# EAGLE design MaxOr (EAGLE 7.3.0)
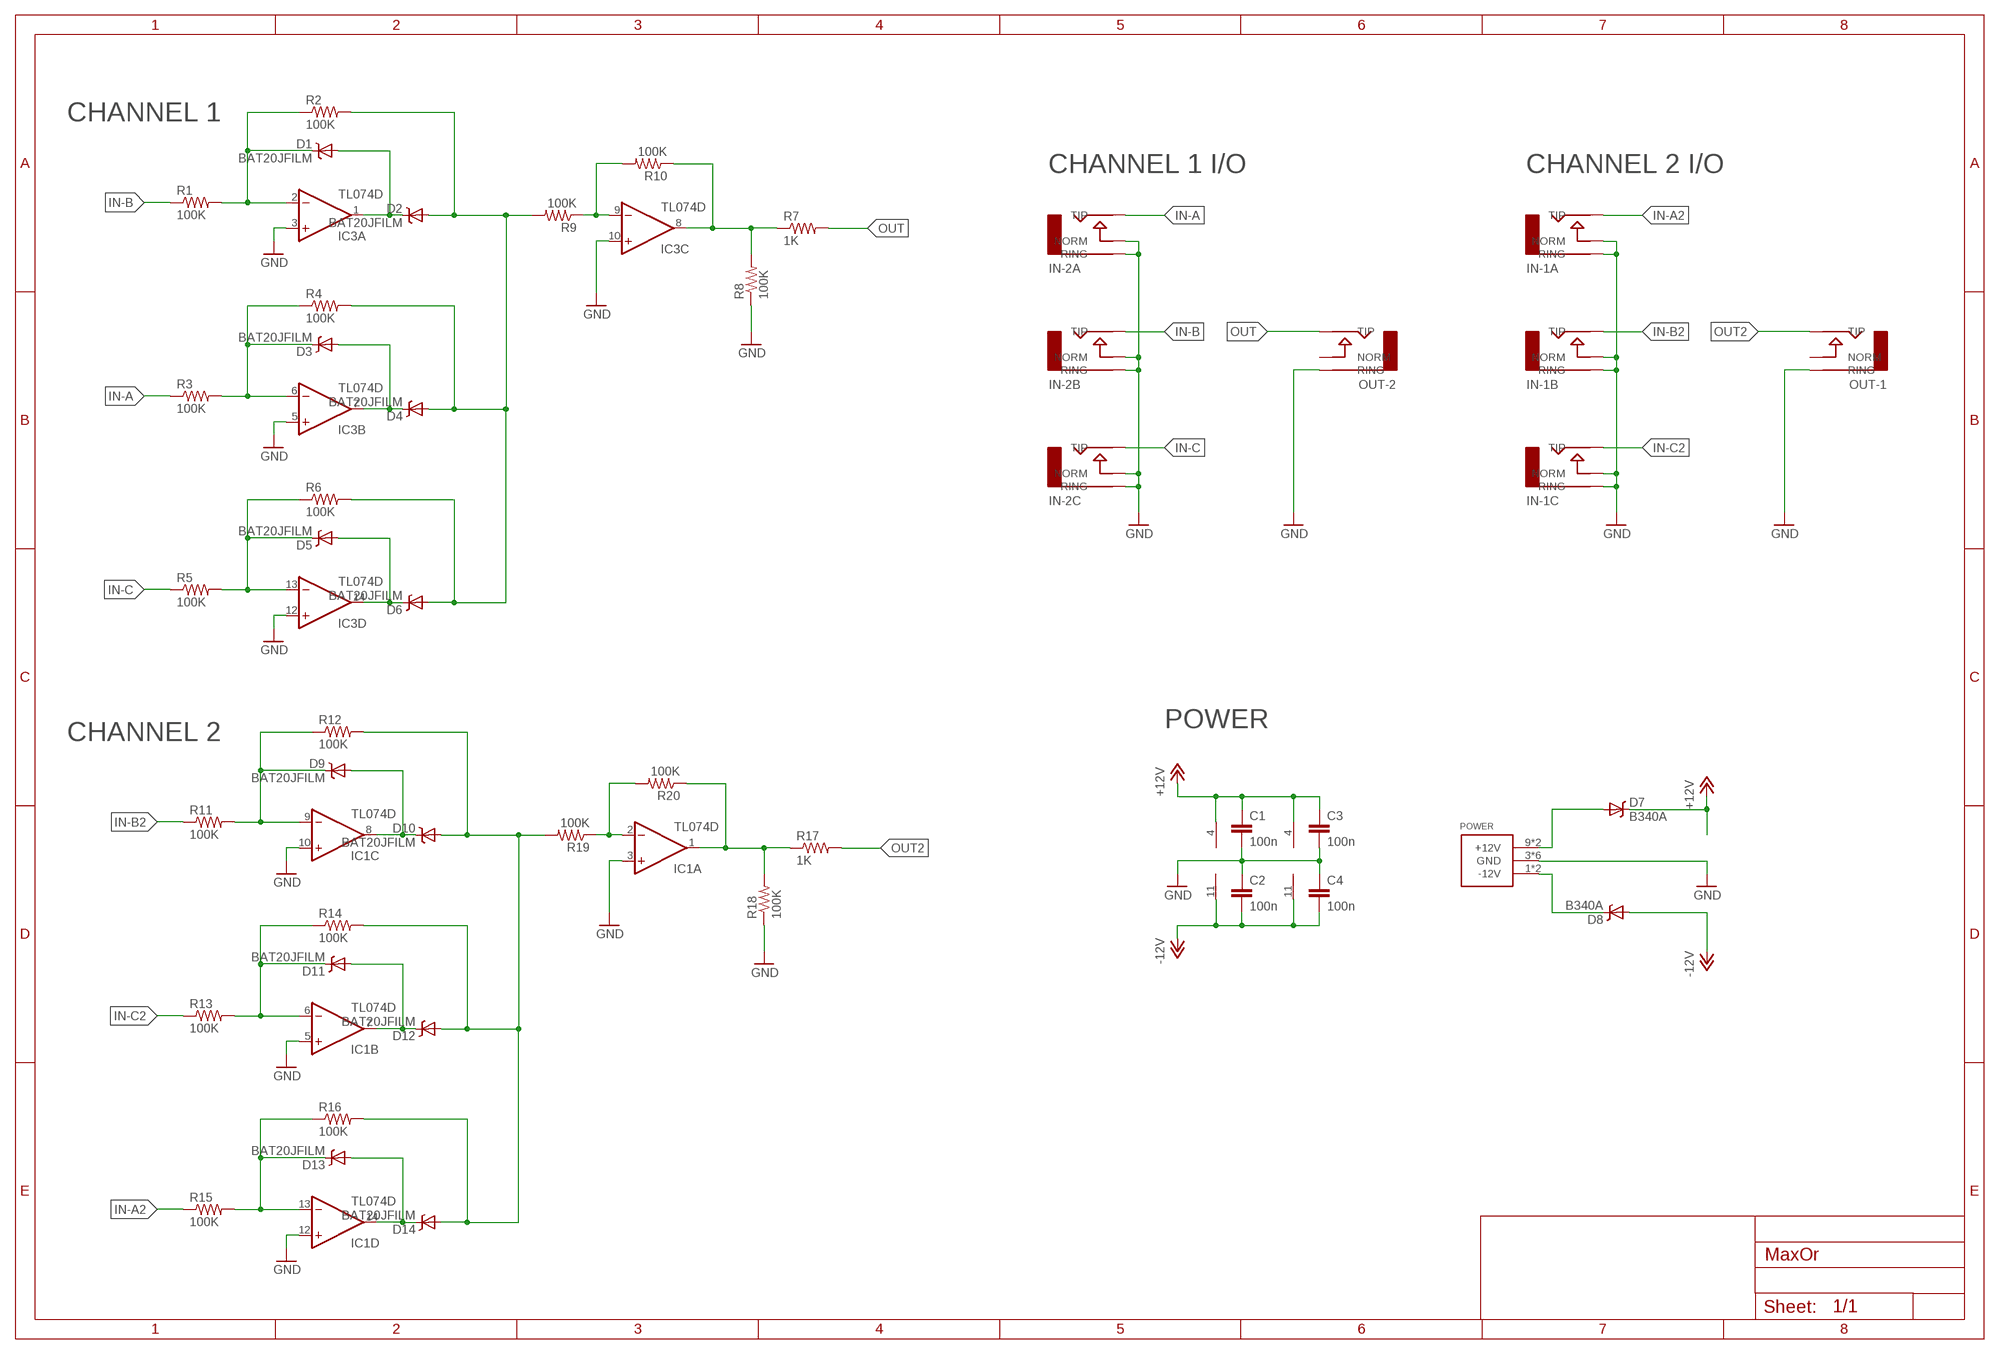
[diagram p0: schematic, sheet 1]

## Parts
C1  100n  CAP0805  [0805]
C2  100n  CAP0805  [0805]
C3  100n  CAP0805  [0805]
C4  100n  CAP0805  [0805]
D1  BAT20JFILM  [SOD-323]
D2  BAT20JFILM  [SOD-323]
D3  BAT20JFILM  [SOD-323]
D4  BAT20JFILM  [SOD-323]
D5  BAT20JFILM  [SOD-323]
D6  BAT20JFILM  [SOD-323]
D7  B340A  DIODE-SCHOTTKY-B340A  [SMA-DIODE]
D8  B340A  DIODE-SCHOTTKY-B340A  [SMA-DIODE]
D9  BAT20JFILM  [SOD-323]
D10  BAT20JFILM  [SOD-323]
D11  BAT20JFILM  [SOD-323]
D12  BAT20JFILM  [SOD-323]
D13  BAT20JFILM  [SOD-323]
D14  BAT20JFILM  [SOD-323]
IC1  TL074D  [SO14]
IC3  TL074D  [SO14]
IN-1A  AUDIO-JACK  [ERTHENVAR-JACK-HORIZONTAL]
IN-1B  AUDIO-JACK  [ERTHENVAR-JACK-HORIZONTAL]
IN-1C  AUDIO-JACK  [ERTHENVAR-JACK-HORIZONTAL]
IN-2A  AUDIO-JACK  [ERTHENVAR-JACK-HORIZONTAL]
IN-2B  AUDIO-JACK  [ERTHENVAR-JACK-HORIZONTAL]
IN-2C  AUDIO-JACK  [ERTHENVAR-JACK-HORIZONTAL]
OUT-1  AUDIO-JACK  [ERTHENVAR-JACK-HORIZONTAL]
OUT-2  AUDIO-JACK  [ERTHENVAR-JACK-HORIZONTAL]
POWER  POWER_SIMPLE10  [POWER_10]
R1  100K  RESISTOR0805-RES  [0805]
R2  100K  RESISTOR0805-RES  [0805]
R3  100K  RESISTOR0805-RES  [0805]
R4  100K  RESISTOR0805-RES  [0805]
R5  100K  RESISTOR0805-RES  [0805]
R6  100K  RESISTOR0805-RES  [0805]
R7  1K  RESISTOR0805-RES  [0805]
R8  100K  RESISTOR0805-RES  [0805]
R9  100K  RESISTOR0805-RES  [0805]
R10  100K  RESISTOR0805-RES  [0805]
R11  100K  RESISTOR0805-RES  [0805]
R12  100K  RESISTOR0805-RES  [0805]
R13  100K  RESISTOR0805-RES  [0805]
R14  100K  RESISTOR0805-RES  [0805]
R15  100K  RESISTOR0805-RES  [0805]
R16  100K  RESISTOR0805-RES  [0805]
R17  1K  RESISTOR0805-RES  [0805]
R18  100K  RESISTOR0805-RES  [0805]
R19  100K  RESISTOR0805-RES  [0805]
R20  100K  RESISTOR0805-RES  [0805]

## Nets
+12V: C1.1 C3.1 D7.C IC1.4(P:V+) IC3.4(P:V+)
-12V: C2.2 C4.2 D8.A IC1.11(P:V-) IC3.11(P:V-)
BUFFER: IC3.8(C:OUT) R7.1 R8.2 R10.1
BUFFER1: IC1.1(A:OUT) R17.1 R18.2 R20.1
GND: C1.2 C2.1 C3.2 C4.1 IC1.3(A:+IN) IC1.5(B:+IN) IC1.10(C:+IN) IC1.12(D:+IN) IC3.3(A:+IN) IC3.5(B:+IN) IC3.10(C:+IN) IC3.12(D:+IN) IN-1A.N(NORM) IN-1A.R@2(RING) IN-1B.N(NORM) IN-1B.R@2(RING) IN-1C.N(NORM) IN-1C.R@2(RING) IN-2A.N(NORM) IN-2A.R@2(RING) IN-2B.N(NORM) IN-2B.R@2(RING) IN-2C.N(NORM) IN-2C.R@2(RING) OUT-1.R@2(RING) OUT-2.R@2(RING) POWER.3(GND) POWER.4(GND) POWER.5(GND) POWER.6(GND) POWER.7(GND) POWER.8(GND) R8.1 R18.1
IN-A: IN-2A.T(TIP) R3.1
IN-A2: IN-1A.T(TIP) R15.1
IN-B: IN-2B.T(TIP) R1.1
IN-B2: IN-1B.T(TIP) R11.1
IN-C: IN-2C.T(TIP) R5.1
IN-C2: IN-1C.T(TIP) R13.1
N$1: D1.A D2.C IC3.1(A:OUT)
N$2: D3.A D4.C IC3.7(B:OUT)
N$3: D1.C IC3.2(A:-IN) R1.2 R2.1
N$4: D3.C IC3.6(B:-IN) R3.2 R4.1
N$5: D5.A D6.C IC3.14(D:OUT)
N$6: D5.C IC3.13(D:-IN) R5.2 R6.1
N$8: D7.A POWER.9(+12V) POWER.10(+12V)
N$9: D8.C POWER.1(-12V) POWER.2(-12V)
N$16: IC3.9(C:-IN) R9.1 R10.2
N$17: D9.A D10.C IC1.8(C:OUT)
N$18: D9.C IC1.9(C:-IN) R11.2 R12.1
N$19: D11.A D12.C IC1.7(B:OUT)
N$20: D11.C IC1.6(B:-IN) R13.2 R14.1
N$21: D13.A D14.C IC1.14(D:OUT)
N$22: D13.C IC1.13(D:-IN) R15.2 R16.1
N$23: IC1.2(A:-IN) R19.1 R20.2
OUT: OUT-2.T(TIP) R7.2
OUT2: OUT-1.T(TIP) R17.2
PREBUFFERED: D2.A D4.A D6.A R2.2 R4.2 R6.2 R9.2
PREBUFFERED1: D10.A D12.A D14.A R12.2 R14.2 R16.2 R19.2
Unconnected: OUT-1.N(NORM) OUT-2.N(NORM)

## Notes on the sheet
- CHANNEL 1
- CHANNEL 1 I/O | CHANNEL 2 I/O
- POWER
- CHANNEL 2

## Library data of the parts
C1-C4 = SparkFun-Capacitors:CAP: Capacitor Standard 0603 ceramic capacitor, and 0.1" leaded capacitor.
D1-D6 D9-D14 = SparkFun-DiscreteSemi:BAT20JFILM: 23V, 1A Schottky diode, SOD-323 package; PROD_ID: DIO-11623
D7 D8 = SparkFun-DiscreteSemi:DIODE-SCHOTTKY: Schottky diodes in SFE's production catalog BAT20J 1A 23V 0.62Vf RB751 120mA 40V 0.37Vf PMEG4005EJ 0.5A 40V 0.42Vf MBRA140 1A 40V 0.5Vf B340A 3A 40V SMA; PROD_ID: DIO-09886
IC1 IC3 = linear:TL074: OP AMP
IN-1A IN-1B IN-1C IN-2A IN-2B IN-2C OUT-1 OUT-2 = erthenvar:AUDIO-JACK: Switching Mono 3.5mm Audio Jack from Erthenvar. Horizontal package.
POWER = eurorack:POWER_SIMPLE
R1-R20 = SparkFun-Resistors:RESISTOR: Resistor Basic schematic elements and footprints for 0603, 1206, and PTH resistors.

## Board
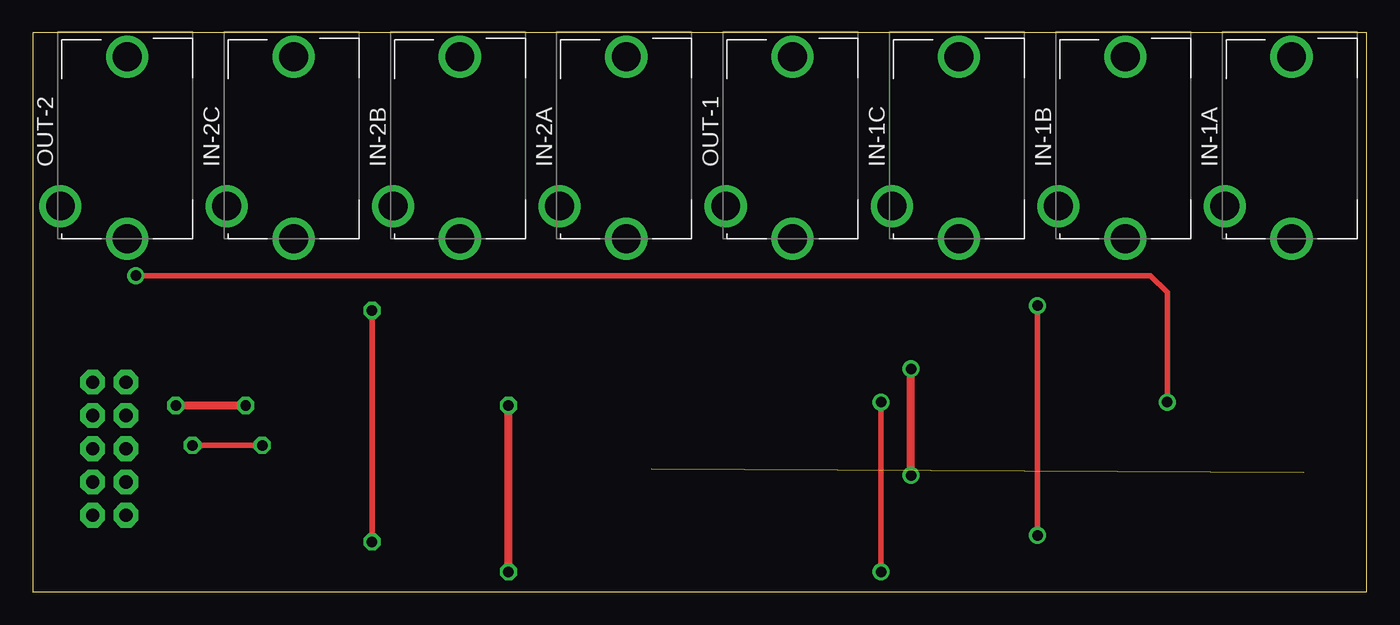
[diagram p1: board, top side]
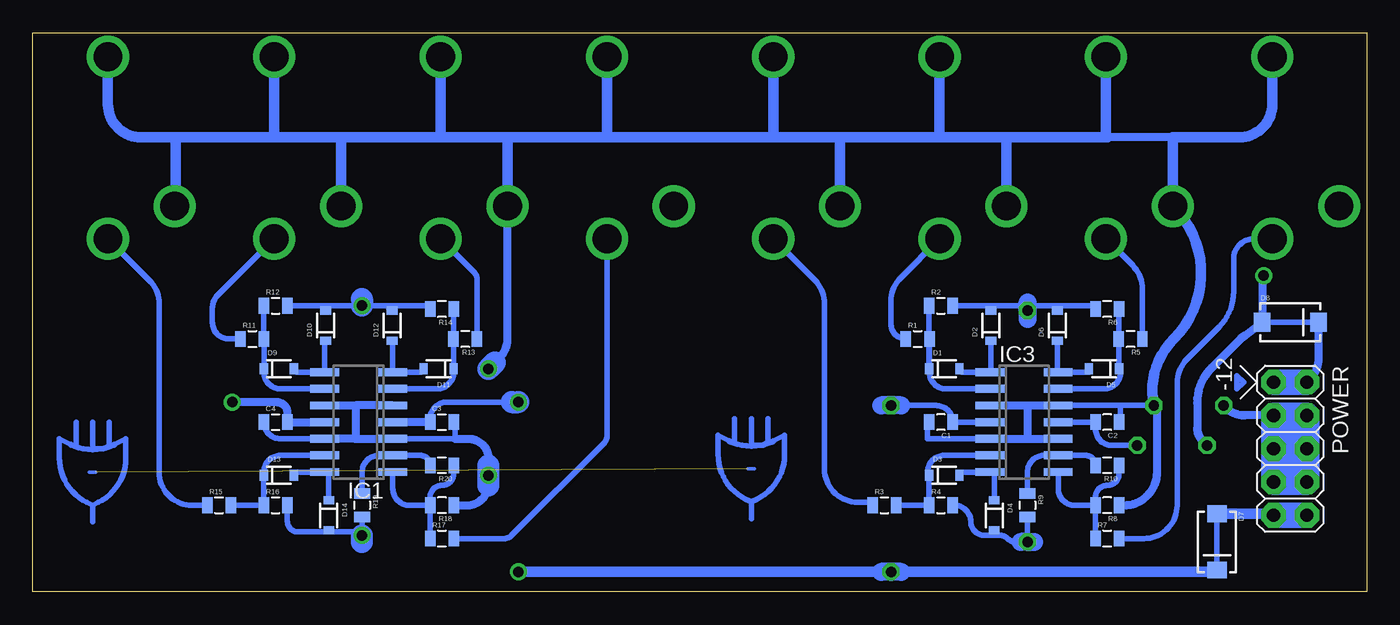
[diagram p2: board, bottom side, seen from below]

Size 101.85 x 42.67 mm. Coordinates in mm from the lower left corner, seen from the top.
Outline: 0,42.67 0,0 101.85,0 101.85,42.67 0,42.67
Copper layers (1*16): Top 0.035mm / dielectric 1.5mm / Bottom 0.035mm
Design rules "Othermill-DRC-1-64": minimum track width 8mil, minimum drill 0.8mm, track to track 0.39878125mm, track to pad 0.39878125mm, pad to pad 0.39878125mm, via to via 0.39878125mm, smd to smd 0mil, copper to edge 0mil, drill to drill 1mil, minimum pad ring 10mil, minimum via ring 10mil, stop-mask expansion 1mil, vias tented up to drill 30mil, thermal gap 10mil

### Footprints (pad centres in the part's own frame; a part is rotated, then mirrored left to right if it is on the bottom)
0805 = smd 0.8 x 1.2: 1 -0.9,0; 2 0.9,0
SOD-323 = smd 0.63 x 0.83: A 1.15,0; C -1.15,0
SMA-DIODE = smd 1.27 x 1.47: A -2.15,0; C 2.15,0
SO14 = smd 0.6 x 2.2: 1 -3.81,-2.6; 2 -2.54,-2.6; 3 -1.27,-2.6; 4 0,-2.6; 5 1.27,-2.6; 6 2.54,-2.6; 7 3.81,-2.6; 8 3.81,2.6; 9 2.54,2.6; 10 1.27,2.6; 11 0,2.6; 12 -1.27,2.6; 13 -2.54,2.6; 14 -3.81,2.6
ERTHENVAR-JACK-HORIZONTAL = drill 2.2: N -5.1,5; R@2 6.3,-0.1; T -7.6,-0.1
POWER_10 = drill 1.016 pad 1.88 octagon: 1 -5.08,-1.27; 2 -5.08,1.27; 3 -2.54,-1.27; 4 -2.54,1.27; 5 0,-1.27; 6 0,1.27; 7 2.54,-1.27; 8 2.54,1.27; 9 5.08,-1.27; 10 5.08,1.27

### Placement (x,y rotation side)
C1  32.51,12.95 180 bottom
C2  19.81,12.95 180 bottom
C3  70.61,12.95 0 bottom
C4  83.31,12.95 0 bottom
D1  32.26,17.02 0 bottom
D2  28.7,20.32 90 bottom
D3  32.26,8.89 0 bottom
D4  28.45,5.84 270 bottom
D5  20.07,17.02 180 bottom
D6  23.62,20.32 90 bottom
D7  11.43,3.81 270 bottom
D8  5.84,20.57 0 bottom
D9  83.06,17.02 0 bottom
D10  79.5,20.32 90 bottom
D11  70.87,17.02 180 bottom
D12  74.42,20.32 90 bottom
D13  83.06,8.89 0 bottom
D14  79.25,5.84 270 bottom
IC1  76.96,12.95 90 bottom
IC3  26.16,12.95 270 bottom
IN-1A  96.01,34.54 90 top
IN-1B  83.31,34.54 90 top
IN-1C  70.61,34.54 90 top
IN-2A  45.21,34.54 90 top
IN-2B  32.51,34.54 90 top
IN-2C  19.81,34.54 90 top
OUT-1  57.91,34.54 90 top
OUT-2  7.11,34.54 90 top
POWER  5.84,10.92 270 bottom
R1  34.29,19.3 0 bottom
R2  32.51,21.84 0 bottom
R3  36.83,6.6 0 bottom
R4  32.51,6.6 0 bottom
R5  18.03,19.3 180 bottom
R6  19.81,21.59 180 bottom
R7  19.81,4.06 0 bottom
R8  19.81,6.6 180 bottom
R9  25.91,6.6 270 bottom
R10  19.81,9.65 180 bottom
R11  85.09,19.3 0 bottom
R12  83.31,21.84 0 bottom
R13  68.83,19.3 180 bottom
R14  70.61,21.59 180 bottom
R15  87.63,6.6 0 bottom
R16  83.31,6.6 0 bottom
R17  70.61,4.06 0 bottom
R18  70.61,6.6 180 bottom
R19  76.71,6.6 270 bottom
R20  70.61,9.65 180 bottom

### Tracks (layer width: path | path; a pad name or v marks a point on that pad's centre or on a via)
+12V  (via drill 0.8)
  Top 0.406: v64.77,1.52 v64.77,14.48
  Top 0.61: v36.32,1.52 v36.32,14.22
  Bottom 0.406: IC3.4 C1.1 arc-90 32.88,14.22 35.56,14.22 | C3.1 71.51,13.21 arc90 70.24,14.48 65.28,14.48
  Bottom 0.61: v36.32,1.52 35.05,1.52 | C3.1 IC1.4
  Bottom 0.813: D7.C arc90 11.57,1.52 v36.32,1.52 v64.77,1.52
  Bottom 1.372: 35.56,14.22 v36.32,14.22 37.08,14.22 | 35.56,1.52 v36.32,1.52 37.08,1.52
  Bottom 1.676: 65.28,14.48 v64.77,14.48
-12V  (via drill 0.8)
  Top 0.406: v12.19,11.18 v17.53,11.18 | v86.61,14.48 86.61,22.86 85.34,24.13 v7.87,24.13
  Bottom 0.406: 20.57,12.95 C2.2 | IC3.11 C2.2 | C2.2 20.71,12.45 arc-90 19.44,11.18 v17.53,11.18 | 82.3,12.95 82.3,13.21 | v7.87,24.13 arc-90 7.99,24.01
  Bottom 0.61: D8.A 8.07,20.57 | 9.63,19.32 11.84,17.12 arc-45 12.95,14.42 12.95,12.46 arc-45 12.58,11.57 v12.19,11.18 | 9.63,19.32 arc8 9.35,19.57 | IC1.11 82.3,12.95 C4.2 82.41,13.66 arc-90 83.23,14.48 v86.61,14.48 | 7.99,24.01 D8.A | D8.A 9.63,19.32
BUFFER
  Bottom 0.406: IC3.8 23.56,7.87 arc-90 22.29,6.6 R8.2 | R8.2 R7.1 | R8.2 20.71,7.23 arc90 19.81,8.13 arc-90 18.91,9.03 R10.1
BUFFER1
  Bottom 0.406: R17.1 R18.2 | R18.2 71.51,7.23 arc90 70.61,8.13 arc-90 69.71,9.03 R20.1 | IC1.1 74.36,7.87 arc-90 73.09,6.6 R18.2
GND  (via drill 0.8)
  Top 0.61: v10.92,14.22 v16.26,14.22 | v67.06,8.89 v67.06,17.02
  Bottom 0.406: C1.2 33.53,12.95 33.53,11.68 IC3.5 | 18.8,14.22 18.8,12.95 C2.1 | 18.8,14.22 v16.26,14.22 | IC3.12 18.8,14.22 | IC1.12 82.94,11.68 arc90 C4.1 | IC1.3 69.6,11.68 69.6,12.84 arc-90 C3.2 | R18.1 69.6,6.6
  Bottom 0.61: POWER.3 9.34,13.46 arc45 10.77,14.07 v10.92,14.22 | 25.91,14.22 25.91,11.68 | R8.1 18.54,6.6 arc-90 16,9.14 16,13.68 arc-45 16.24,14.21 v16.26,14.22 | 14.73,29.25 arc-45 IN-2C.N | 14.81,34.69 19.81,34.69 arc90 19.91,34.79 | 27.51,34.61 arc90 27.43,34.69 | 32.61,34.79 arc-90 32.51,34.69 | IC3.3 25.91,14.22 | IC3.5 25.91,11.68 | 77.22,11.68 IC1.12 | IC1.10 77.22,14.22 | 77.22,14.22 77.22,11.68 | IC1.5 77.22,14.22 | 77.22,11.68 IC1.3 | 69.6,11.68 68.58,11.68 arc90 67.06,10.16 67.06,9.65 v67.06,8.89 | 66.57,17.51 arc-45 65.61,19.09 IN-1C.N | 69.6,6.6 68.83,6.6 arc-90 67.06,8.13 | 25.91,14.22 IC3.12 | 25.91,11.68 IC3.10
  Bottom 0.813: IN-2A.N 40.21,34.69 | 19.81,34.69 27.43,34.69 32.51,34.69 40.21,34.69 | OUT-2.R@2 7.21,37.23 arc90 9.75,34.69 14.81,34.69 IN-2C.N arc91 14.73,19.3 arc-57 v16.26,14.22 | IN-2C.R@2 19.91,34.79 | IN-2B.N 27.51,34.61 | IN-2B.R@2 32.61,34.79 | IN-2A.R@2 45.31,34.69 | 45.31,34.69 58.01,34.69 | 90.93,34.69 93.57,34.69 arc90 96.11,37.23 IN-1A.R@2 | IN-1A.N arc-90 90.93,29.52 90.93,34.69 | 90.93,34.69 83.41,34.69 | 83.41,34.69 IN-1B.R@2 | 83.41,34.69 78.31,34.69 | 78.31,34.69 IN-1B.N | 78.31,34.69 70.71,34.69 | 70.71,34.69 IN-1C.R@2 | 70.71,34.69 65.61,34.69 | 65.61,34.69 IN-1C.N | 65.61,34.69 58.01,34.69 | 58.01,34.69 OUT-1.R@2 | 40.21,34.69 45.31,34.69
  Bottom 1.676: 67.06,8.13 67.06,9.65 | 66.57,17.51 v67.06,17.02
  Bottom 1.93: POWER.4 POWER.6 | POWER.6 POWER.8 | POWER.8 5.84,9.65 5.84,12.19 POWER.4 | POWER.4 POWER.3 POWER.5 | POWER.8 POWER.7 POWER.5 | POWER.6 POWER.5
IN-A
  Bottom 0.406: R3.1 arc-45 37.83,6.84 38.86,6.84 arc90 41.4,9.38 41.4,21.98 arc-45 42.15,23.78 IN-2A.T
IN-A2
  Bottom 0.406: IN-1A.T 92.95,23.78 arc45 92.2,21.98 92.2,9.14 arc-90 89.66,6.6 R15.1
IN-B
  Bottom 0.406: R1.1 arc90 36.32,20.44 36.32,22.18 arc45 35.58,23.98 IN-2B.T
IN-B2
  Bottom 0.406: R11.1 86.87,19.3 arc90 88.14,20.57 88.14,21.69 arc45 87.77,22.59 IN-1B.T
IN-C
  Bottom 0.406: 17.02,19.3 R5.1 17.13,23.11 arc-45 17.88,24.91 IN-2C.T
IN-C2
  Bottom 0.406: R13.1 67.93,23.83 arc-45 68.17,24.4 IN-1C.T
LABEL
  Bottom 0.406: 97.28,6.6 96.85,6.82 arc-63 94.74,10.23 94.74,11.68 95.58,11.27 | 97.28,6.6 97.72,6.82 arc63 99.82,10.23 99.82,11.68 98.99,11.27 | 98.99,11.27 arc-53 95.58,11.27 | 96.01,12.95 96.01,11.18 | 98.55,12.95 98.55,11.18 98.77,11.18 arc45 98.99,11.27 | 96.01,11.18 95.8,11.18 arc-45 95.58,11.27 | 97.28,12.95 97.28,10.92 96.62,10.92 arc-45 96.01,11.18 | 97.28,6.6 97.28,5.33
LABEL1
  Bottom 0.406: 46.99,6.86 46.56,7.08 arc-63 44.45,10.48 44.45,11.94 45.29,11.52 | 46.99,6.86 47.42,7.08 arc63 49.53,10.48 49.53,11.94 48.69,11.52 | 48.69,11.52 arc-53 45.29,11.52 | 45.72,13.21 45.72,11.43 | 48.26,13.21 48.26,11.43 48.48,11.43 arc45 48.69,11.52 | 45.72,11.43 45.5,11.43 arc-45 45.29,11.52 | 46.99,13.21 46.99,11.18 46.33,11.18 arc-45 45.72,11.43 | 46.99,6.86 46.99,5.59
N$1
  Bottom 0.406: 28.7,16.76 IC3.1 | IC3.1 30.85,16.76 arc90 D1.A | D2.C 28.7,16.82 arc90 IC3.1
N$2
  Bottom 0.406: 28.7,9.14 IC3.7 | IC3.7 31.11,9.14 D3.A | D4.C 28.45,9.14 IC3.7
N$3
  Bottom 0.406: IC3.2 32.14,15.49 arc90 33.39,16.75 33.39,17.04 | R2.1 33.41,17.53 arc90 33.41,17.52 D1.C arc-90 33.39,17.04 | 33.41,19.3 R1.2 33.39,17.04
N$4
  Bottom 0.406: IC3.6 32.26,10.41 arc-90 33.53,9.14 33.53,8.89 D3.C R4.1 | R4.1 | R3.2 R4.1
N$5
  Bottom 0.406: D6.C 23.62,16.76 IC3.14 21.22,16.76 D5.A
N$6
  Bottom 0.406: IC3.13 20.07,15.49 arc-90 18.8,16.76 18.91,16.76 | R6.1 18.91,19.3 | 18.91,16.76 18.91,19.3 | 18.91,19.3 R5.2 | D5.C 18.92,16.76 18.91,16.76
N$8
  Bottom 0.61: D7.A arc-90 11.31,5.84
  Bottom 0.813: POWER.9 arc-90 7.23,5.96 D7.A
  Bottom 1.93: POWER.10 POWER.9
N$9
  Bottom 0.61: D8.C 3.69,17.62 arc45 POWER.2
  Bottom 1.93: POWER.1 POWER.2
N$12
  Bottom 0.406: 3.3,20.57 8.38,20.57
N$13
  Bottom 0.406: 9.91,16.51 9.4,16 9.91,15.49 9.91,16.51
N$14
  Bottom 0.406: 11.43,5.84 11.43,1.52
N$16
  Bottom 0.406: R9.1 25.91,9.14 arc90 24.64,10.41 IC3.9 21.47,10.41 arc90 R10.2
N$17
  Bottom 0.406: D10.C arc-90 79.56,19.11 IC1.8 81.65,16.76 arc90 D9.A
N$18
  Bottom 0.406: R12.1 84.21,19.36 arc-45 R11.2 84.19,17.06 arc45 D9.C 84.21,16.76 arc-90 82.94,15.49 IC1.9
N$19
  Bottom 0.406: D12.C arc90 74.36,19.11 IC1.7 72.27,16.76 arc-90 D11.A
N$20
  Bottom 0.406: IC1.6 70.99,15.49 arc-90 69.72,16.76 D11.C arc90 69.73,17.04 R13.2 arc-90 69.71,19.33 R14.1
N$21
  Bottom 0.406: D14.C 79.25,8.83 arc-90 IC1.14 81.65,9.14 arc-90 D13.A
N$22
  Bottom 0.406: R15.2 R16.1 arc-90 R16.1 D13.C 84.21,9.14 arc90 82.94,10.41 IC1.13
N$23
  Bottom 0.406: R19.1 76.71,9.14 arc90 75.44,10.41 IC1.2 72.27,10.41 arc90 R20.2
N$27  (1 unrouted)
  Bottom 0.254: 46.74,9.4 47.24,9.4 | 97.03,9.14 97.54,9.14
OUT
  Bottom 0.406: R7.2 17.02,4.06 arc-90 14.48,6.6 14.48,15.97 arc45 13.73,17.76 11.28,20.22 arc-45 10.16,22.91 10.16,25.42 arc90 8.64,26.94 OUT-2.T
OUT2
  Bottom 0.406: OUT-1.T 58.01,11.92 arc45 58.25,11.35 65.29,4.3 arc45 65.87,4.06 R17.2
PREBUFFERED  (via drill 0.8)
  Top 0.406: v25.91,3.81 v25.91,21.47
  Bottom 0.406: R4.2 31.5,6.6 arc90 30.23,5.33 arc-90 29.21,4.32 28.45,4.32 | R2.2 28.7,21.84 | 28.7,21.84 25.91,21.84 | 20.71,21.47 R6.2 20.71,21.84 23.62,21.84 | 28.45,4.32 D4.A | 23.62,21.59 D6.A 23.62,21.84 | 25.91,21.59 25.91,21.84 | 23.62,21.84 25.91,21.84 | D2.A 28.7,21.84 | R9.2 v25.91,3.81 | 28.45,4.32 28.05,4.32 arc45 27.43,4.06 arc-45 26.82,3.81 26.42,3.81
  Bottom 1.372: 25.91,22.1 25.91,21.59 v25.91,21.47 25.91,20.83 | 26.42,3.81 v25.91,3.81 25.4,3.81
PREBUFFERED1  (via drill 0.8)
  Top 0.406: v76.71,4.32 v76.71,21.84
  Top 0.813: v76.71,21.84 arc90 76.71,21.59
  Bottom 0.406: R12.2 79.5,21.84 | 74.68,21.84 v76.71,21.84 79.5,21.84 | 74.68,21.84 71.77,21.84 arc90 R14.2 | D12.A arc90 74.68,21.72 74.68,21.84 | R19.2 76.71,4.57 | 76.71,4.57 76.71,3.81 | D14.A 79.27,4.67 arc45 79.5,4.57 | 82.3,6.49 arc-90 R16.2 82.41,5.38 arc-90 81.6,4.57 79.5,4.57 | D10.A 79.5,21.84 | 79.5,4.57 76.71,4.57
  Bottom 1.676: 76.71,22.35 v76.71,21.84 | 76.71,3.81 v76.71,4.32